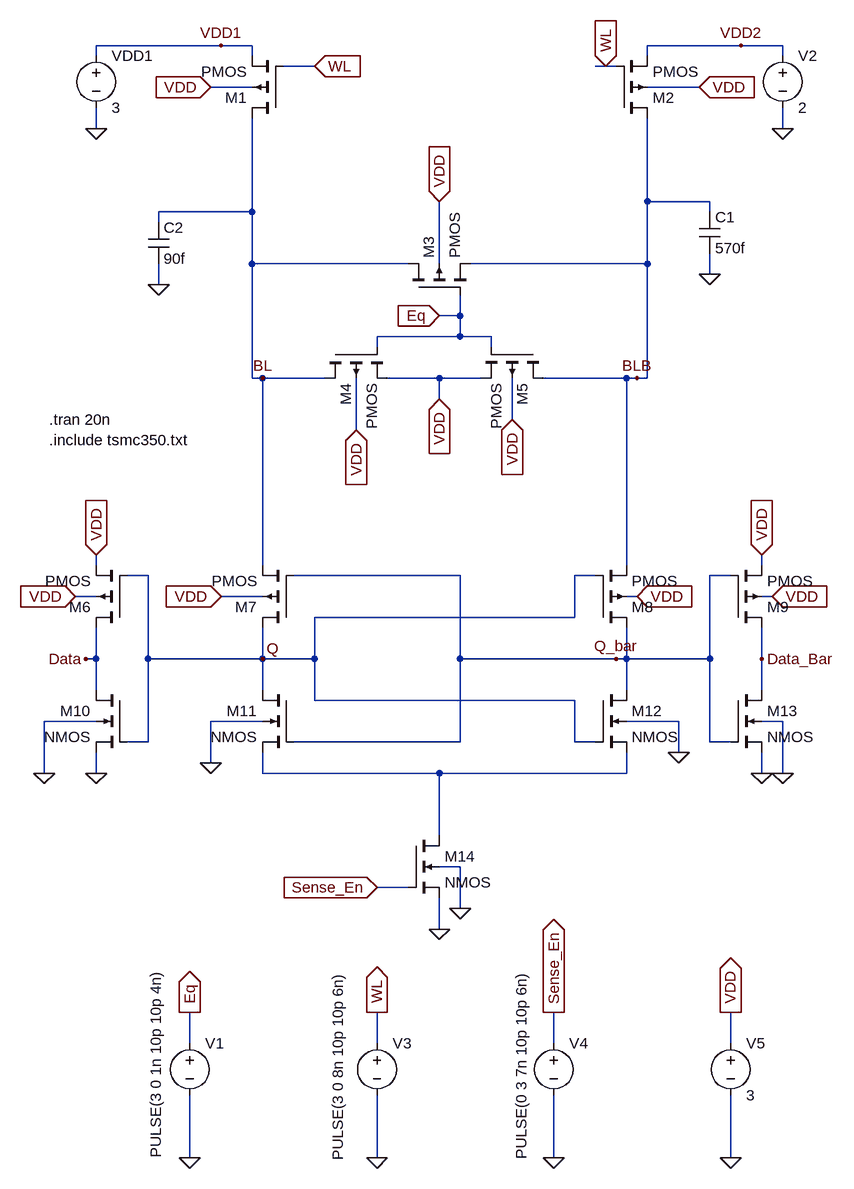
[diagram p0: schematic LAB8t2.asc]
LAB8t2.asc, the LTspice schematic file:
Version 4
SHEET 1 944 1952
WIRE 0 16 -192 16
WIRE 48 16 0 16
WIRE 800 16 656 16
WIRE 864 16 800 16
WIRE -192 32 -192 16
WIRE 48 32 48 16
WIRE 656 32 656 16
WIRE 864 32 864 16
WIRE 144 48 96 48
WIRE 592 48 576 48
WIRE 608 48 592 48
WIRE 48 80 -16 80
WIRE 736 80 656 80
WIRE -192 144 -192 112
WIRE 864 144 864 112
WIRE 656 256 656 128
WIRE 752 256 656 256
WIRE 48 272 48 128
WIRE 48 272 -96 272
WIRE 752 272 752 256
WIRE -96 288 -96 272
WIRE 48 352 48 272
WIRE 288 352 48 352
WIRE 336 352 336 256
WIRE 656 352 656 256
WIRE 656 352 384 352
WIRE 752 368 752 336
WIRE -96 384 -96 352
WIRE 368 432 368 400
WIRE 368 432 336 432
WIRE 368 464 368 432
WIRE 368 464 240 464
WIRE 416 464 368 464
WIRE 240 480 240 464
WIRE 416 480 416 464
WIRE 48 528 48 352
WIRE 64 528 48 528
WIRE 160 528 64 528
WIRE 336 528 256 528
WIRE 400 528 336 528
WIRE 624 528 496 528
WIRE 640 528 624 528
WIRE 656 528 656 352
WIRE 656 528 640 528
WIRE 336 560 336 528
WIRE 448 592 448 528
WIRE 208 608 208 528
WIRE -192 816 -192 800
WIRE 64 816 64 528
WIRE 624 816 624 528
WIRE 832 816 832 800
WIRE -112 832 -144 832
WIRE 368 832 112 832
WIRE 576 832 544 832
WIRE 784 832 752 832
WIRE -192 864 -224 864
WIRE 64 864 0 864
WIRE 640 864 624 864
WIRE 848 864 832 864
WIRE 544 896 544 832
WIRE 544 896 144 896
WIRE -192 960 -192 912
WIRE -192 960 -208 960
WIRE -112 960 -112 832
WIRE 64 960 64 912
WIRE 64 960 -112 960
WIRE 144 960 144 896
WIRE 144 960 64 960
WIRE 368 960 368 832
WIRE 608 960 368 960
WIRE 624 960 624 912
WIRE 624 960 608 960
WIRE 752 960 752 832
WIRE 752 960 624 960
WIRE 832 960 832 912
WIRE -192 1008 -192 960
WIRE 64 1008 64 960
WIRE 624 1008 624 960
WIRE 832 1008 832 960
WIRE 144 1024 144 960
WIRE 544 1024 144 1024
WIRE -192 1056 -272 1056
WIRE 64 1056 -16 1056
WIRE 704 1056 624 1056
WIRE 864 1056 832 1056
WIRE -112 1088 -112 960
WIRE -112 1088 -144 1088
WIRE 368 1088 368 960
WIRE 368 1088 112 1088
WIRE 544 1088 544 1024
WIRE 576 1088 544 1088
WIRE 752 1088 752 960
WIRE 784 1088 752 1088
WIRE 704 1104 704 1056
WIRE -16 1120 -16 1056
WIRE -272 1136 -272 1056
WIRE -192 1136 -192 1104
WIRE 64 1136 64 1104
WIRE 336 1136 64 1136
WIRE 624 1136 624 1104
WIRE 624 1136 336 1136
WIRE 832 1136 832 1104
WIRE 864 1136 864 1056
WIRE 336 1232 336 1136
WIRE 368 1280 336 1280
WIRE 288 1312 240 1312
WIRE 368 1344 368 1280
WIRE 336 1376 336 1328
WIRE -48 1552 -48 1504
WIRE 240 1552 240 1504
WIRE 512 1552 512 1504
WIRE 784 1552 784 1504
WIRE -48 1728 -48 1632
WIRE 240 1728 240 1632
WIRE 512 1728 512 1632
WIRE 784 1728 784 1632
FLAG -192 144 0
FLAG 864 144 0
FLAG -96 384 0
FLAG 752 368 0
FLAG 336 1376 0
FLAG 592 48 WL
IOPIN 592 48 In
FLAG 736 80 VDD
IOPIN 736 80 In
FLAG -16 80 VDD
IOPIN -16 80 In
FLAG 144 48 WL
IOPIN 144 48 In
FLAG 0 16 VDD1
FLAG 800 16 VDD2
FLAG 336 256 VDD
IOPIN 336 256 In
FLAG 336 432 Eq
IOPIN 336 432 In
FLAG 336 560 VDD
IOPIN 336 560 In
FLAG 208 608 VDD
IOPIN 208 608 In
FLAG 448 592 VDD
IOPIN 448 592 In
FLAG 64 528 BL
FLAG 640 528 BLB
FLAG -192 800 VDD
IOPIN -192 800 In
FLAG -224 864 VDD
IOPIN -224 864 In
FLAG 640 864 VDD
IOPIN 640 864 In
FLAG 832 800 VDD
IOPIN 832 800 In
FLAG 848 864 VDD
IOPIN 848 864 In
FLAG 0 864 VDD
IOPIN 0 864 In
FLAG -208 960 Data
FLAG 832 960 Data_Bar
FLAG 240 1312 Sense_En
IOPIN 240 1312 In
FLAG -48 1728 0
FLAG 240 1728 0
FLAG 512 1728 0
FLAG 784 1728 0
FLAG -48 1504 Eq
IOPIN -48 1504 Out
FLAG 240 1504 WL
IOPIN 240 1504 Out
FLAG 512 1504 Sense_En
IOPIN 512 1504 Out
FLAG 784 1504 VDD
IOPIN 784 1504 Out
FLAG 704 1104 0
FLAG 832 1136 0
FLAG -16 1120 0
FLAG -192 1136 0
FLAG -272 1136 0
FLAG 864 1136 0
FLAG 368 1344 0
FLAG 64 960 Q
FLAG 608 960 Q_bar
SYMBOL pmos4 96 128 R180
SYMATTR InstName M1
SYMATTR Value2 l=350n w=5u
SYMBOL pmos4 608 128 M180
SYMATTR InstName M2
SYMATTR Value2 l=350n w=5u
SYMBOL pmos4 288 400 R270
SYMATTR InstName M3
SYMATTR Value2 l=350n w=10u
SYMBOL pmos4 160 480 M90
SYMATTR InstName M4
SYMATTR Value2 l=350n w=10u
SYMBOL pmos4 496 480 R90
SYMATTR InstName M5
SYMATTR Value2 l=350n w=10u
SYMBOL Voltage -192 16 R0
SYMATTR InstName VDD1
SYMATTR Value 3
SYMBOL Voltage 864 16 R0
SYMATTR InstName V2
SYMATTR Value 2
SYMBOL Cap 736 272 R0
SYMATTR InstName C1
SYMATTR Value 570f
SYMBOL Cap -112 288 R0
SYMATTR InstName C2
SYMATTR Value 90f
SYMBOL pmos4 -144 912 R180
SYMATTR InstName M6
SYMATTR Value2 l=350n w=1u
SYMBOL pmos4 112 912 R180
SYMATTR InstName M7
SYMATTR Value2 l=350n w=1u
SYMBOL pmos4 576 912 M180
SYMATTR InstName M8
SYMATTR Value2 l=350n w=1u
SYMBOL pmos4 784 912 M180
SYMATTR InstName M9
SYMATTR Value2 l=350n w=1u
SYMBOL nmos4 -144 1008 M0
SYMATTR InstName M10
SYMATTR Value2 l=350n w=500n
SYMBOL nmos4 112 1008 M0
SYMATTR InstName M11
SYMATTR Value2 l=350n w=500n
SYMBOL nmos4 576 1008 R0
SYMATTR InstName M12
SYMATTR Value2 l=350n w=500n
SYMBOL nmos4 784 1008 R0
SYMATTR InstName M13
SYMATTR Value2 l=350n w=500n
SYMBOL nmos4 288 1232 R0
SYMATTR InstName M14
SYMATTR Value2 l=350n w=1u
SYMBOL Voltage -48 1536 R0
WINDOW 3 -52 -98 VRight 2
SYMATTR Value PULSE(3 0 1n 10p 10p 4n)
SYMATTR InstName V1
SYMBOL Voltage 240 1536 R0
WINDOW 3 -60 -94 VRight 2
SYMATTR Value PULSE(3 0 8n 10p 10p 6n)
SYMATTR InstName V3
SYMBOL Voltage 512 1536 R0
WINDOW 3 -50 -96 VRight 2
SYMATTR Value PULSE(0 3 7n 10p 10p 6n)
SYMATTR InstName V4
SYMBOL Voltage 784 1536 R0
SYMATTR InstName V5
SYMATTR Value 3
TEXT -264 592 Left 2 !.tran 20n\n.include tsmc350.txt

The netlist it stands for:
* LAB8t2.asc
M1 BL WL VDD1 VDD PMOS l=350n w=5u
M2 BLB WL VDD2 VDD PMOS l=350n w=5u
M3 BL Eq BLB VDD PMOS l=350n w=10u
M4 BL Eq VDD VDD PMOS l=350n w=10u
M5 BLB Eq VDD VDD PMOS l=350n w=10u
VDD1 VDD1 0 3
V2 VDD2 0 2
C1 BLB 0 570f
C2 BL 0 90f
M6 Data Q VDD VDD PMOS l=350n w=1u
M7 Q Q_bar BL VDD PMOS l=350n w=1u
M8 Q_bar Q BLB VDD PMOS l=350n w=1u
M9 Data_Bar Q_bar VDD VDD PMOS l=350n w=1u
M10 Data Q 0 0 NMOS l=350n w=500n
M11 Q Q_bar N001 0 NMOS l=350n w=500n
M12 Q_bar Q N001 0 NMOS l=350n w=500n
M13 Data_Bar Q_bar 0 0 NMOS l=350n w=500n
M14 N001 Sense_En 0 0 NMOS l=350n w=1u
V1 Eq 0 PULSE(3 0 1n 10p 10p 4n)
V3 WL 0 PULSE(3 0 8n 10p 10p 6n)
V4 Sense_En 0 PULSE(0 3 7n 10p 10p 6n)
V5 VDD 0 3
.model NMOS NMOS
.model PMOS PMOS
.lib standard.mos
.tran 20n
.include tsmc350.txt
.backanno
.end